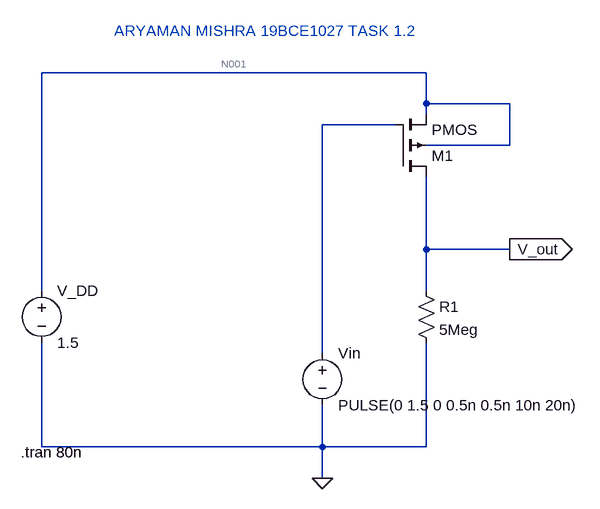
[diagram p0: schematic Draft3.asc]
Draft3.asc, the LTspice schematic file:
Version 4
SHEET 1 916 680
WIRE 656 -16 64 -16
WIRE 656 32 656 -16
WIRE 784 32 656 32
WIRE 656 48 656 32
WIRE 608 64 496 64
WIRE 784 96 784 32
WIRE 784 96 656 96
WIRE 656 256 656 144
WIRE 784 256 656 256
WIRE 64 320 64 -16
WIRE 656 320 656 256
WIRE 496 416 496 64
WIRE 64 560 64 400
WIRE 496 560 496 496
WIRE 496 560 64 560
WIRE 656 560 656 400
WIRE 656 560 496 560
WIRE 496 608 496 560
FLAG 496 608 0
FLAG 784 256 V_out
IOPIN 784 256 Out
SYMBOL voltage 64 304 R0
WINDOW 123 0 0 Left 0
WINDOW 39 0 0 Left 0
SYMATTR InstName V_DD
SYMATTR Value 1.5
SYMBOL voltage 496 400 R0
WINDOW 123 0 0 Left 0
WINDOW 39 0 0 Left 0
SYMATTR InstName Vin
SYMATTR Value PULSE(0 1.5 0 0.5n 0.5n 10n 20n)
SYMBOL pmos4 608 144 M180
SYMATTR InstName M1
SYMBOL res 640 304 R0
SYMATTR InstName R1
SYMATTR Value 5Meg
TEXT 32 568 Left 2 !.tran 80n
TEXT 176 -80 Left 2 ;ARYAMAN MISHRA 19BCE1027 TASK 1.2

The netlist it stands for:
* Draft3.asc
V_DD N001 0 1.5
Vin N002 0 PULSE(0 1.5 0 0.5n 0.5n 10n 20n)
M1 V_out N002 N001 N001 PMOS
R1 V_out 0 5Meg
.model NMOS NMOS
.model PMOS PMOS
.lib standard.mos
.tran 80n
* ARYAMAN MISHRA 19BCE1027 TASK 1.2
.backanno
.end

* Results of the author's LTspice run, read from the files saved beside the schematic
* Operating Point, zero values left out:
*   V(n001) = 1.5 V
*   V(v_out) = 1.49 V
*   Id(M1) = -298 nA
*   Is(M1) = 298 nA
*   I(R1) = 298 nA
*   I(V_dd) = -298 nA